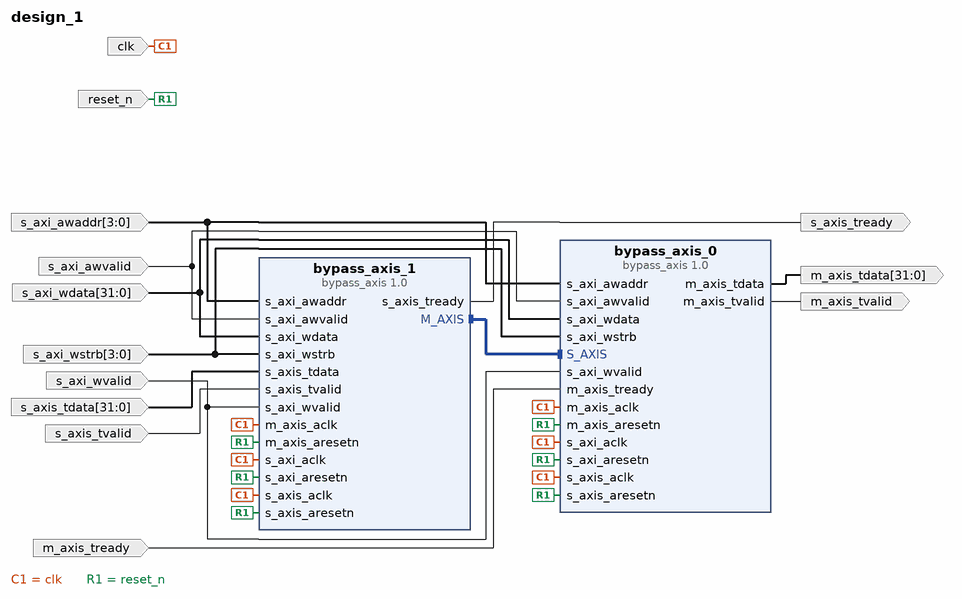
[diagram p0: block diagram of the top level]
# Vivado block design design_1, Vivado 2015.2
create_bd_design design_1

create_bd_port -dir I -type clk clk
set_property -dict {CONFIG.FREQ_HZ 100000000} [get_bd_ports clk]
create_bd_port -dir I -type rst reset_n
create_bd_port -dir I -from 3 -to 0 s_axi_awaddr
create_bd_port -dir I s_axi_awvalid
create_bd_port -dir I -from 31 -to 0 s_axi_wdata
create_bd_port -dir I -from 3 -to 0 s_axi_wstrb
create_bd_port -dir I s_axi_wvalid
create_bd_port -dir I -from 31 -to 0 s_axis_tdata
create_bd_port -dir I s_axis_tvalid
create_bd_port -dir O s_axis_tready
create_bd_port -dir O -from 31 -to 0 m_axis_tdata
create_bd_port -dir O m_axis_tvalid
create_bd_port -dir I m_axis_tready

create_bd_cell -type ip -vlnv xilinx.com:user:bypass_axis:1.0 bypass_axis_0
create_bd_cell -type ip -vlnv xilinx.com:user:bypass_axis:1.0 bypass_axis_1

# ---- connections ----

connect_bd_intf_net [get_bd_intf_pins bypass_axis_1/M_AXIS] [get_bd_intf_pins bypass_axis_0/S_AXIS]
connect_bd_net [get_bd_ports clk] \
  [get_bd_pins bypass_axis_0/s_axi_aclk] [get_bd_pins bypass_axis_0/s_axis_aclk] [get_bd_pins bypass_axis_0/m_axis_aclk] \
  [get_bd_pins bypass_axis_1/s_axi_aclk] [get_bd_pins bypass_axis_1/s_axis_aclk] [get_bd_pins bypass_axis_1/m_axis_aclk]
connect_bd_net [get_bd_ports reset_n] \
  [get_bd_pins bypass_axis_0/s_axi_aresetn] [get_bd_pins bypass_axis_0/s_axis_aresetn] \
  [get_bd_pins bypass_axis_0/m_axis_aresetn] [get_bd_pins bypass_axis_1/s_axi_aresetn] \
  [get_bd_pins bypass_axis_1/s_axis_aresetn] [get_bd_pins bypass_axis_1/m_axis_aresetn]
connect_bd_net [get_bd_ports s_axi_awaddr] [get_bd_pins bypass_axis_0/s_axi_awaddr] [get_bd_pins bypass_axis_1/s_axi_awaddr]
connect_bd_net [get_bd_ports s_axi_awvalid] [get_bd_pins bypass_axis_0/s_axi_awvalid] [get_bd_pins bypass_axis_1/s_axi_awvalid]
connect_bd_net [get_bd_ports s_axi_wdata] [get_bd_pins bypass_axis_0/s_axi_wdata] [get_bd_pins bypass_axis_1/s_axi_wdata]
connect_bd_net [get_bd_ports s_axi_wstrb] [get_bd_pins bypass_axis_0/s_axi_wstrb] [get_bd_pins bypass_axis_1/s_axi_wstrb]
connect_bd_net [get_bd_ports s_axi_wvalid] [get_bd_pins bypass_axis_0/s_axi_wvalid] [get_bd_pins bypass_axis_1/s_axi_wvalid]
connect_bd_net [get_bd_ports s_axis_tdata] [get_bd_pins bypass_axis_1/s_axis_tdata]
connect_bd_net [get_bd_ports s_axis_tvalid] [get_bd_pins bypass_axis_1/s_axis_tvalid]
connect_bd_net [get_bd_pins bypass_axis_1/s_axis_tready] [get_bd_ports s_axis_tready]
connect_bd_net [get_bd_pins bypass_axis_0/m_axis_tdata] [get_bd_ports m_axis_tdata]
connect_bd_net [get_bd_pins bypass_axis_0/m_axis_tvalid] [get_bd_ports m_axis_tvalid]
connect_bd_net [get_bd_ports m_axis_tready] [get_bd_pins bypass_axis_0/m_axis_tready]

validate_bd_design
save_bd_design
